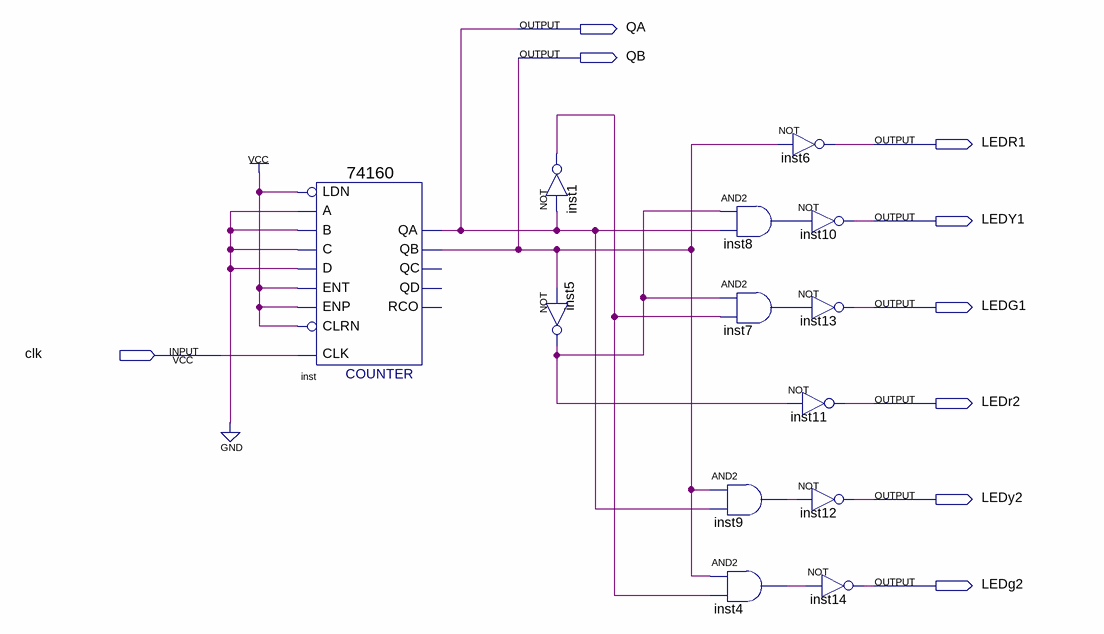
[diagram p0: schematic sheet]
// Quartus schematic trafficcontroller.bdf as structural Verilog: 13 symbols, 9 pins
module trafficcontroller (
  input  clk,
  output QA,
  output QB,
  output LEDR1,
  output LEDY1,
  output LEDG1,
  output LEDr2,
  output LEDy2,
  output LEDg2
);

  wire inst1_out, inst4_out, inst5_out, inst7_out, inst8_out, inst9_out;

  \74160  inst (
    .CLK(clk), .ENT(1'b1), .A(1'b0), .B(1'b0), .C(1'b0), .D(1'b0), .LDN(1'b1), .ENP(1'b1), .CLRN(1'b1),
    .QA(QA), .QB(QB));  // open: QD, QC, RCO
  not inst1 (inst1_out, QA);
  not inst5 (inst5_out, QB);
  and inst8 (inst8_out, inst5_out, QA);
  and inst7 (inst7_out, inst5_out, inst1_out);
  and inst9 (inst9_out, QB, QA);
  and inst4 (inst4_out, QB, inst1_out);
  not inst6 (LEDR1, QB);
  not inst10 (LEDY1, inst8_out);
  not inst13 (LEDG1, inst7_out);
  not inst11 (LEDr2, inst5_out);
  not inst12 (LEDy2, inst9_out);
  not inst14 (LEDg2, inst4_out);
endmodule
